# Altium schematic sheet ivt33_kuznecov_list1_9var.SchDoc
size 594 x 420 mm; SheetNumber: 1; SheetTotal: 1
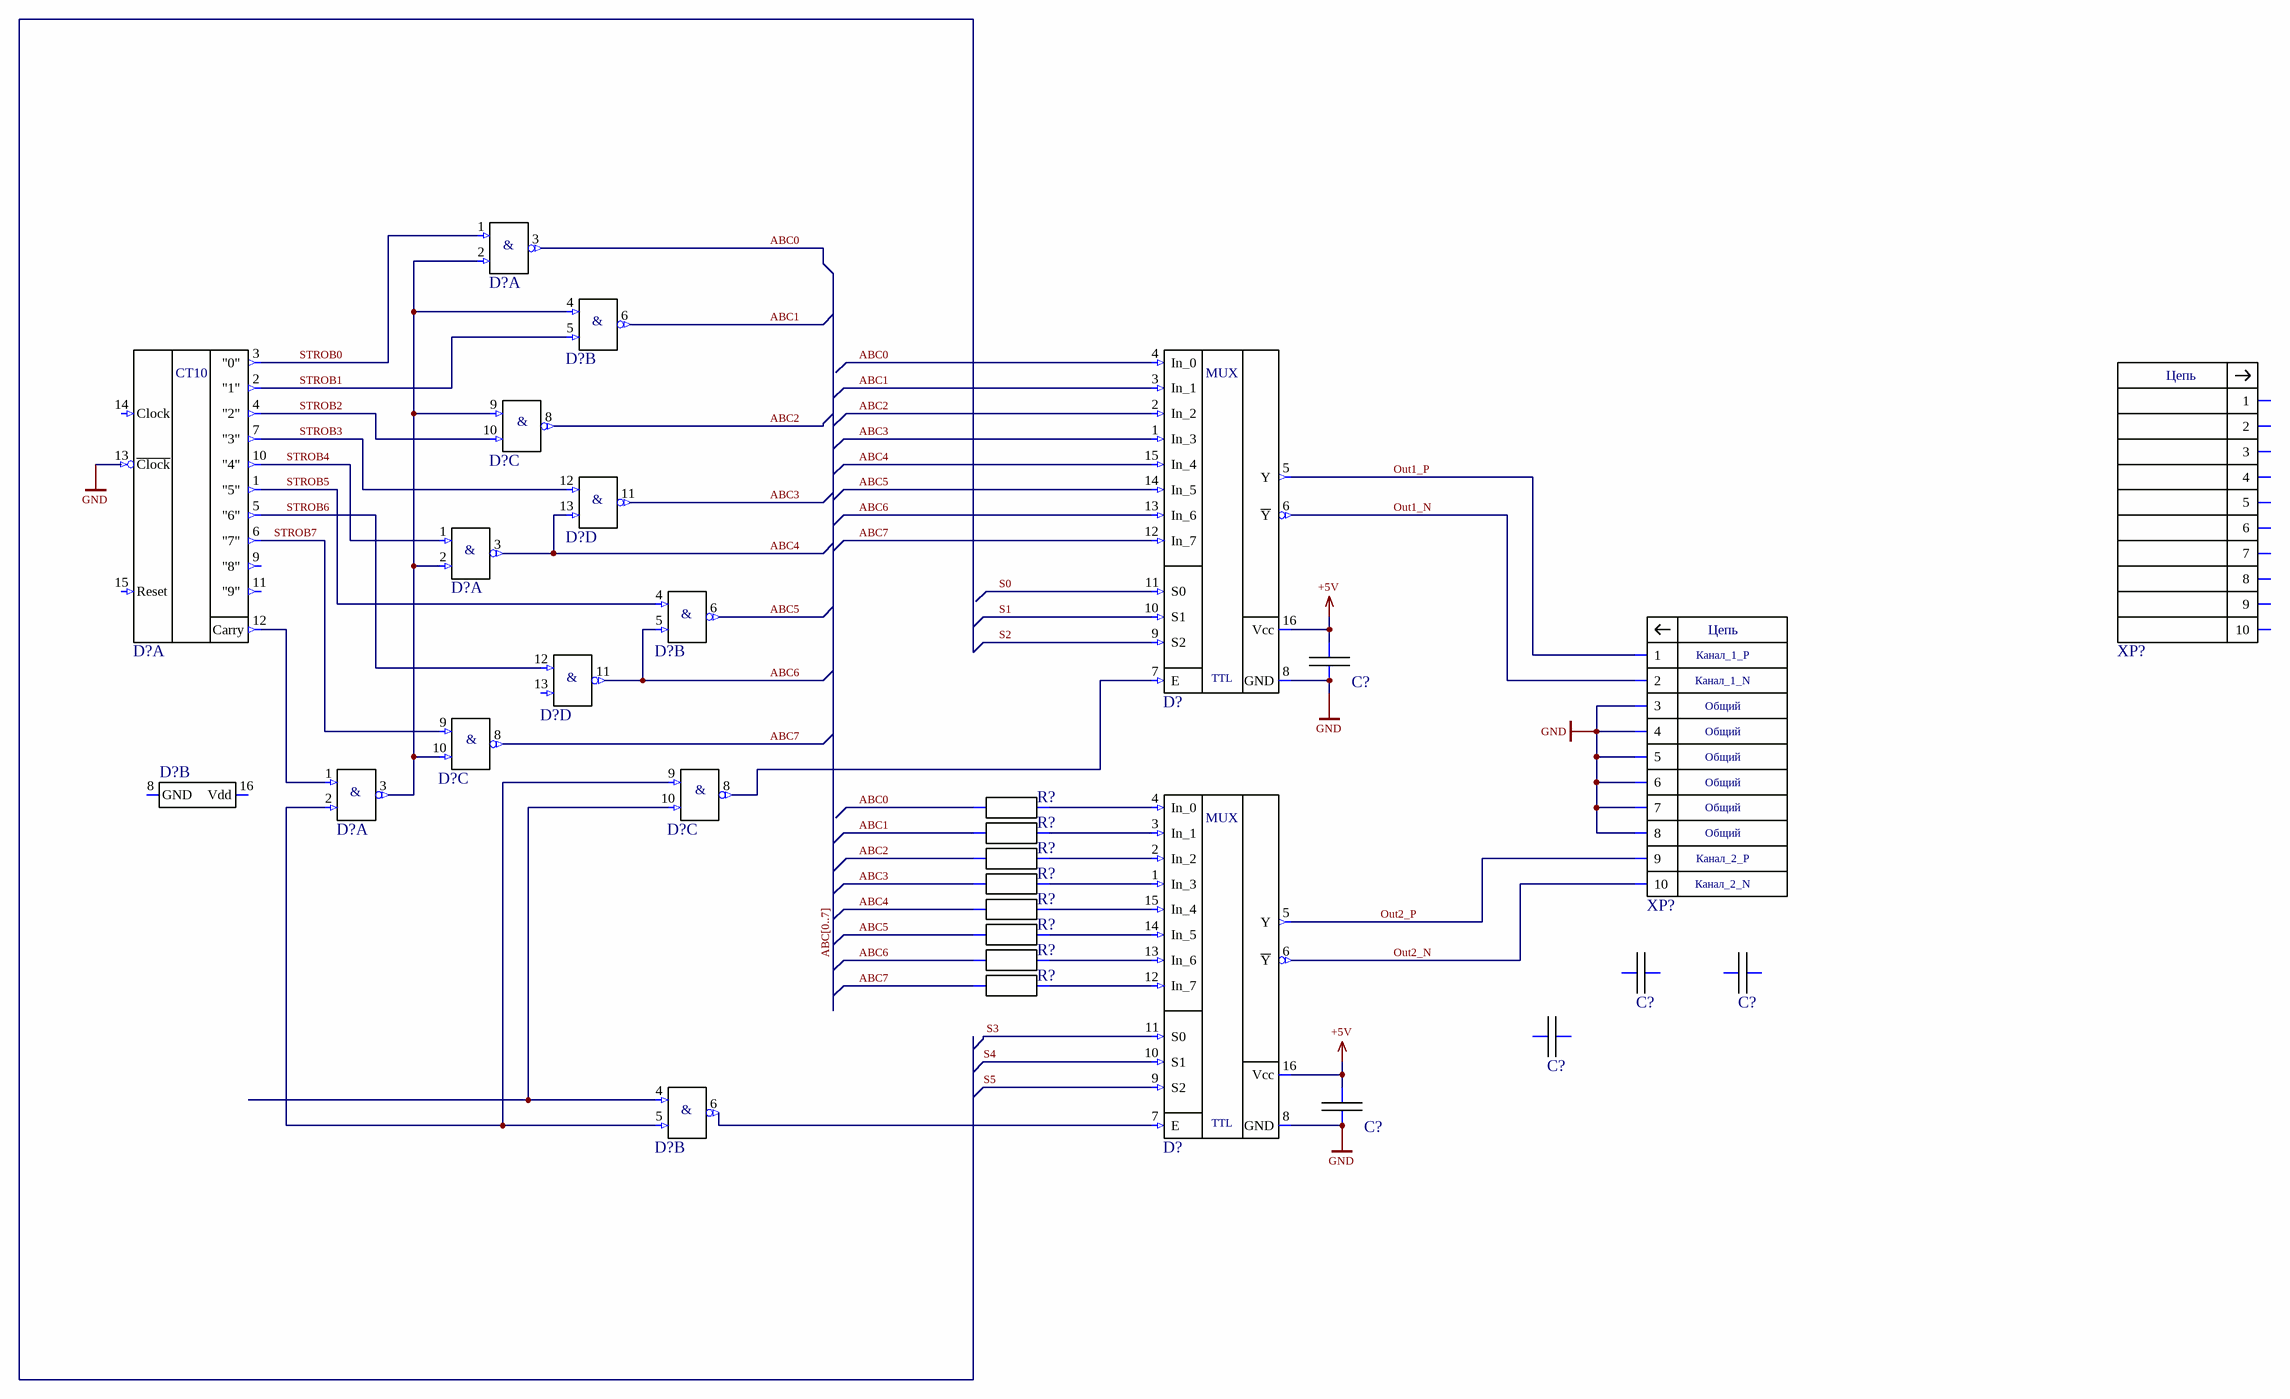
[diagram p0: ivt33_kuznecov_list1_9var.SchDoc]

## Parts
(Parts that share a designator on the sheet are numbered #1, #2 ... from top to bottom, then left to right.)
C?#1  (no value)  [0805_N]
C?#2  (no value)  [0805_N]
C?#3  (no value)  [0805_N]
C?#4  (no value)  [0805_N]
C?#5  (no value)  [0805_N]
D?#1  74AC00SC  [SO14-N]  (value not drawn)  (part A of 5)
D?#2  74AC00SC  [SO14-N]  (value not drawn)  (part B of 5)
D?#3  SOIC-16  [SO16-N]  (value not drawn)  (part A of 2)
D?#4  SOIC-16  [SO16-N]  (value not drawn)
D?#5  74AC00SC  [SO14-N]  (value not drawn)  (part C of 5)
D?#6  74AC00SC  [SO14-N]  (value not drawn)  (part D of 5)
D?#7  74AC00SC  [SO14-N]  (value not drawn)  (part A of 5)
D?#8  74AC00SC  [SO14-N]  (value not drawn)  (part B of 5)
D?#9  74AC00SC  [SO14-N]  (value not drawn)  (part D of 5)
D?#10  74AC00SC  [SO14-N]  (value not drawn)  (part C of 5)
D?#11  SOIC-16  [SO16-N]  (value not drawn)  (part B of 2)
D?#12  74AC00SC  [SO14-N]  (value not drawn)  (part A of 5)
D?#13  74AC00SC  [SO14-N]  (value not drawn)  (part C of 5)
D?#14  SOIC-16  [SO16-N]  (value not drawn)
D?#15  74AC00SC  [SO14-N]  (value not drawn)  (part B of 5)
R?#1  (no value)  [RES_0603_1608_N]
R?#2  (no value)  [RES_0603_1608_N]
R?#3  (no value)  [RES_0603_1608_N]
R?#4  (no value)  [RES_0603_1608_N]
R?#5  (no value)  [RES_0603_1608_N]
R?#6  (no value)  [RES_0603_1608_N]
R?#7  (no value)  [RES_0603_1608_N]
R?#8  (no value)  [RES_0603_1608_N]
XP?#1  TE_1-1634689-0  [BH-10R]  (value not drawn)
XP?#2  TE_1-1634689-0  [BH-10R]  (value not drawn)

## Nets
+5V: C?#1.2 C?#5.2 D?#4.16(Vcc) D?#14.16(Vcc)
GND: C?#1.1 C?#5.1 D?#3.13(~{Clock}) D?#4.8(GND) D?#14.8(GND) XP?#2.3 XP?#2.4 XP?#2.5 XP?#2.6 XP?#2.7 XP?#2.8
ABC0: D?#1.3(Out) D?#4.4(In_0) R?#1.1
ABC1: D?#2.6(Out) D?#4.3(In_1) R?#2.1
ABC2: D?#4.2(In_2) D?#5.8(Out) R?#3.1
ABC3: D?#4.1(In_3) D?#6.11(Out) R?#4.1
ABC4: D?#4.15(In_4) D?#6.13(In2) D?#7.3(Out) R?#5.1
ABC5: D?#4.14(In_5) D?#8.6(Out) R?#6.1
ABC6: D?#4.13(In_6) D?#8.5(In2) D?#9.11(Out) R?#7.1
ABC7: D?#4.12(In_7) D?#10.8(Out) R?#8.1
Out1_N: D?#4.6(~{Y}) XP?#2.2
Out1_P: D?#4.5(Y) XP?#2.1
Out2_N: D?#14.6(~{Y}) XP?#2.10
Out2_P: D?#14.5(Y) XP?#2.9
S0: D?#4.11(S0)
S1: D?#4.10(S1)
S2: D?#4.9(S2)
S3: D?#14.11(S0)
S4: D?#14.10(S1)
S5: D?#14.9(S2)
STROB0: D?#1.1(In1) D?#3.3("0")
STROB1: D?#2.5(In2) D?#3.2("1")
STROB2: D?#3.4("2") D?#5.10(In2)
STROB3: D?#3.7("3") D?#6.12(In1)
STROB4: D?#3.10("4") D?#7.1(In1)
STROB5: D?#3.1("5") D?#8.4(In1)
STROB6: D?#3.5("6") D?#9.12(In1)
STROB7: D?#3.6("7") D?#10.9(In1)
NetD?#1_2: D?#1.2(In2) D?#2.4(In1) D?#5.9(In1) D?#7.2(In2) D?#10.10(In2) D?#12.3(Out)
NetD?#3_12: D?#3.12(Carry) D?#12.1(In1)
NetD?#4_7: D?#4.7(E) D?#13.8(Out)
NetD?#12_2: D?#12.2(In2) D?#13.9(In1) D?#15.5(In2)
NetD?#13_10: D?#13.10(In2) D?#15.4(In1)
NetD?#14_1: D?#14.1(In_3) R?#4.2
NetD?#14_2: D?#14.2(In_2) R?#3.2
NetD?#14_3: D?#14.3(In_1) R?#2.2
NetD?#14_4: D?#14.4(In_0) R?#1.2
NetD?#14_7: D?#14.7(E) D?#15.6(Out)
NetD?#14_12: D?#14.12(In_7) R?#8.2
NetD?#14_13: D?#14.13(In_6) R?#7.2
NetD?#14_14: D?#14.14(In_5) R?#6.2
NetD?#14_15: D?#14.15(In_4) R?#5.2

Not connected (* = marked no-connect by the designer): C?#2 1 2; C?#3 1 2; C?#4 1 2; D?#3 9("8") 11("9") 14(Clock) 15(Reset); D?#9 13(In2); D?#11 8(GND) 16(Vdd); XP?#1 1 2 3 4 5 6 7 8 9 10

## Buses and harness runs
bus ABC[0..7]

## Notes on the sheet
- (near XP?#2) Канал_1_P
- (near XP?#2) Канал_1_N
- Общий
- (near XP?#2) Канал_2_P
- (near XP?#2) Канал_2_N
- Перв. примен.
- Справ. №
- Подп. дата
- Инв. № дубл.
- Взам. инв. №
- Подп. и дата
- Изм.
- Разраб.
- Лист
- № докум.
- Подп.
- Дата
- Лит.
- Масса
- Масштаб
- Пров.
- Т.контр.
- Листов
- Инв. № подл.
- Н.контр.
- Утв.
- ALTIUM GOSTBOM2.0 KEV
- Файл:
- Копировал
- Формат А2
- (in symbol 74AC00SC, part A) &
- (in symbol 74AC00SC, part B) &
- (in symbol 74AC00SC, part C) &
- (in symbol 74AC00SC, part D) &
- (in symbol 74HCT151D) MUX; TTL
- (in symbol HCF4017BM1, part A) CT10
- (in symbol TE_1-1634689-0) Цепь

## Library data of the parts
C?#1-C?#5 = К10-79_0805_Н90: Чип конденсатор 0805 Н90 ряд Е6; Manufacturer: ООО "Кулон"; Name: К10-79; Tolerance: +80%-20%; TU: АЖЯР.673511.004 ТУ; Type: K10-79; BOM: К10-79-*-B-*+80%-20%-Н90 АЖЯР.673511.004 ТУ; Created_by: Желобаев; Name2: Конденсатор К10-79; Version: 0; Weight: 0.05; Voltage: *; TKE: Н90; Value: *; Value_KD: *; Case: 0805; Issue_date: 19_12_2018
D?#1 D?#2 D?#5-D?#10 D?#12 D?#13 D?#15 = 74AC00SC: 4 элемента 2И-НЕ TTL SOIC-14; Manufacturer: ON Semiconductor; BOM: 74AC00SC "ON Semiconductor"; Created_by: Желобаев; Power_Voltage: 4.5 - 5.5 V; Name2: Микросхема 74AC00SC; Issue_date: 10.04.2019; Case: SOIC-14; Version: 0; Name: 74AC00SC
D?#3 D?#11 = HCF4017BM1: Декадный счетчик c 10 декодированными выходами; Manufacturer: STMicroelectronics; Power_Voltage: -0.5 -22 V; BOM: HCF4017BM1 "STMicroelectronics"; Created_by: Желобаев; Name2: Микросхема HCF4017BM1; Case: SOIC-16; Issue_date: 05.04.2019; Name: HCF4017BM1; Version: 0
D?#4 D?#14 = 74HCT151D: мультиплексор 8 канальный TTL; Manufacturer: NXP Semiconductors; Power_Voltage: 4.5 -5.5 V; BOM: 74HCT151D "NXP Semiconductors"; Created_by: Желобаев; Name2: Микросхема 74HCT151D; Case: SOIC-16; Issue_date: 05.04.2019; Name: 74HCT151D; Version: 0
R?#1-R?#8 = Р1-12-0,1-5%: Резистор от 0,75 Ом до 10 МОм; Manufacturer: ОАО "НПО "Эркон"; Tolerance: 5%; TU: АЛЯР.434110.005 ТУ; Voltage: 50; TKR: M; BOM: Р1-12-0,1 * 5%-M-"A" АЛЯР.434110.005 ТУ; Created_by: Желобаев; Name2: Резистор Р1-12-0,1; Version: 00; Type: Р1-12-0,1±5%-М-"А"; Weight: 0,005; Size: 0603; Name: Р1-12-0,1; Value_KD: *; Issue_date: 10.04.2019; Case: 0603
XP?#1 XP?#2 = TE_1-1634689-0: Вилка типа BH-10R угловая правая двухрядная 2х5х2.54; Manufacturer: TE Connectivity; Created_by: Желобаев; BOM: TE_1-1634689-0 "TE Connectivity"; Name2: Вилка угловая TE_1-1634689-0; Name: TE_1-1634689-0; Issue_date: 13.05.2019; Version: 0; Case: BH-10R